# EAGLE design SD_reg (EAGLE 6.2)
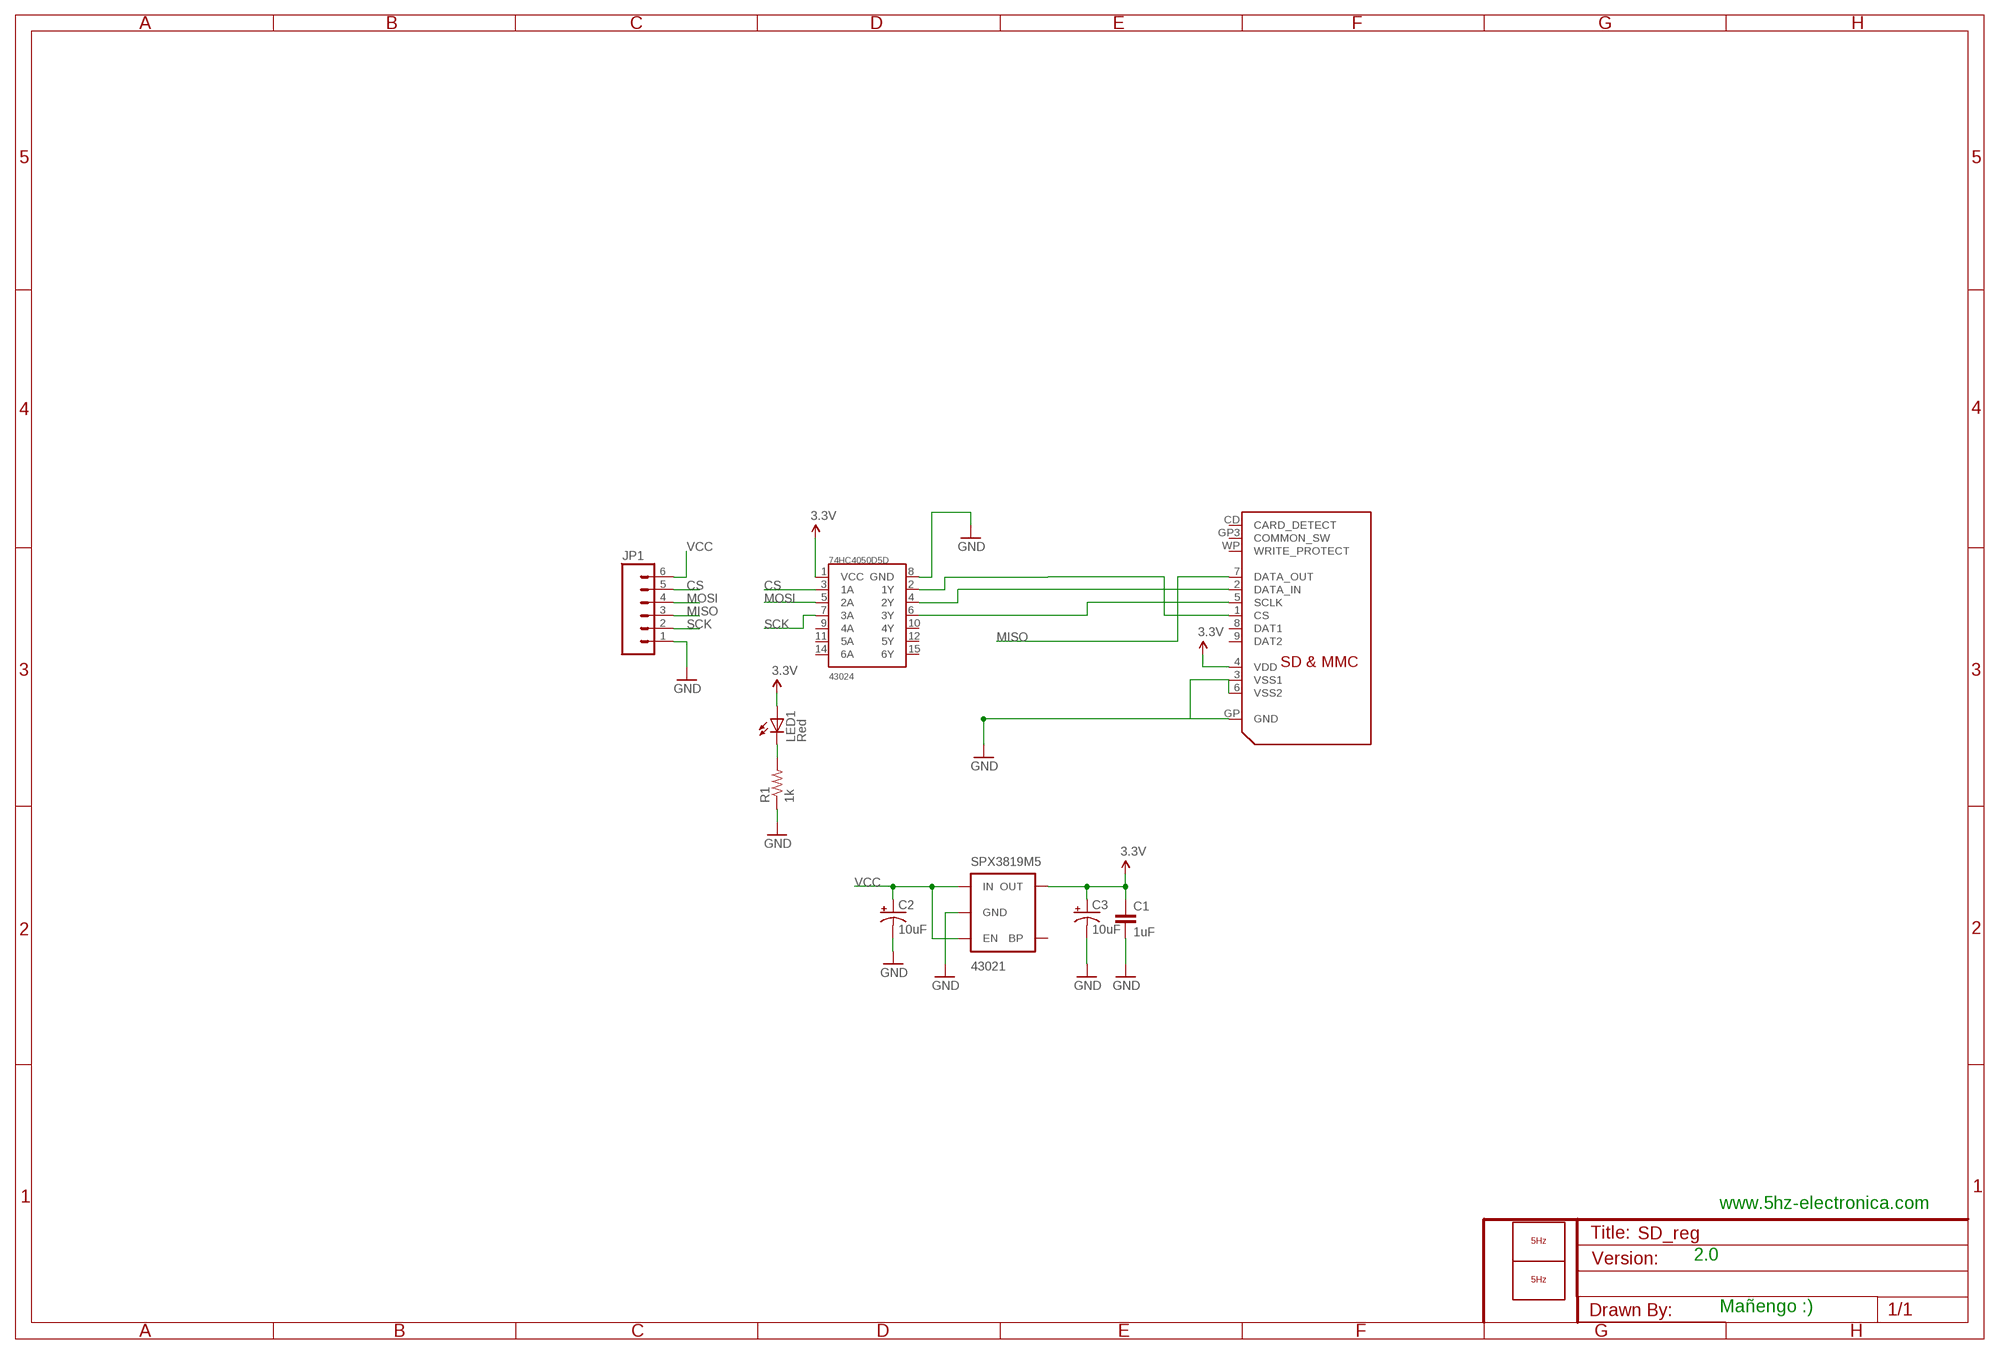
[diagram p0: schematic, sheet 1]

## Parts
74HC4050D5D  43024  HEX_CONVERTER  [SO016]
C1  1uF  CAP0603-CAP  [0603-CAP]
C2  10uF  CAP_POL1206  [EIA3216]
C3  10uF  CAP_POL1206  [EIA3216]
JP1  M06SIP  [1X06]
LED1  Red  LED0603  [LED-0603]
LOGO1  LOGO_5HZ_MAIN_10MM  [5HZ_LOGO_MAIN_10MM]
LOGO2  LOGO_5HZ_CIRC_3MM  [5HZ_LOGO_CIRC_3MM]
R1  1k  RESISTOR0603-RES  [0603-RES]
SPX3819M5  43021  V_REG_LDOSMD  [SOT23-5]
U$1  2041021-4  SDMMC06132  [06132]

## Nets
3.3V: 74HC4050D5D.1(VCC) C1.1 C3.A(+) LED1.A SPX3819M5.5(OUT) U$1.4(VDD)
CS: 74HC4050D5D.3(1A) JP1.5
GND: 74HC4050D5D.8(GND) C1.2 C2.C(-) C3.C(-) JP1.1 R1.1 SPX3819M5.2(GND)
MISO: JP1.3 U$1.7(DATA_OUT)
MOSI: 74HC4050D5D.5(2A) JP1.4
N$2: 74HC4050D5D.4(2Y) U$1.2(DATA_IN)
N$4: 74HC4050D5D.6(3Y) U$1.5(SCLK)
N$6: LED1.C R1.2
N$163: 74HC4050D5D.2(1Y) U$1.1(CS)
SCK: 74HC4050D5D.7(3A) JP1.2
VCC: C2.A(+) JP1.6 SPX3819M5.1(IN) SPX3819M5.3(EN)
VSS2: U$1.3(VSS1) U$1.6(VSS2) U$1.GP(GND) ; supply symbol labelled GND
Unconnected: 74HC4050D5D.9(4A) 74HC4050D5D.10(4Y) 74HC4050D5D.11(5A) 74HC4050D5D.12(5Y) 74HC4050D5D.14(6A) 74HC4050D5D.15(6Y) SPX3819M5.4(BP) U$1.8(DAT1) U$1.9(DAT2) U$1.CD(CARD_DETECT) U$1.GP3(COMMON_SW) U$1.WP(WRITE_PROTECT)

## Notes on the sheet
- www.5hz-electronica.com
- 2.0
- Mañengo :)

## Library data of the parts
74HC4050D5D = SparkFun:HEX_CONVERTER
C1 = SparkFun:CAP: Capacitor Standard 0603 ceramic capacitor, and 0.1" leaded capacitor.
C2 C3 = SparkFun:CAP_POL: Capacitor Polarized These are standard SMD and PTH capacitors. Normally 10uF, 47uF, and 100uF in electrolytic and tantalum varieties. Always verify the external diameter of the through hole cap, it varies with capacity, voltage, and manufacturer. The EIA devices should be standard.
JP1 = SparkFun:M06: Header 6 Standard 6-pin 0.1" header. Use with straight break away headers (SKU : PRT-00116), right angle break away headers (PRT-00553), swiss pins (PRT-00743), machine pins (PRT-00117), and female headers (PRT-00115). Molex polarized connector foot print use with SKU : PRT-08094 with associated crimp pins and housings. NOTES ON THE VARIANTS LOCK and LOCK_LONGPADS... This footprint was designed to help hold the alignment of a through-hole component (i.e. 6-pin header) while soldering it into place. You may notice that each hole has been shifted either up or down by 0.005 of an inch from it's more standard position (which is a perfectly straight line). This slight alteration caused the pins (the squares in the middle) to touch the edges of the holes. Because they are alternating, it causes a "brace" to hold the component in place. 0.005 has proven to be the perfect amount of "off-center" position when using our standard breakaway headers. Although looks a little odd when you look at the bare footprint, once you have a header in there, the alteration is very hard to notice. Also, if you push a header all the way into place, it is covered up entirely on the bottom side. This idea of altering the position of holes to aid alignment will be further integrated into the Sparkfun Library for other footprints. It can help hold any component with 3 or more connection pins.
LED1 = SparkFun:LED: LEDs Standard schematic elements and footprints for 5mm, 3mm, 1206, and 0603 sized LEDs. 5mm - Spark Fun Electronics SKU : COM-00529 (and others)
LOGO1 LOGO2 = 5hz-electronica:LOGO_5HZ: Logotipo 5Hz "según Pedro"
R1 = SparkFun:RESISTOR: Resistor Basic schematic elements and footprints for 0603, 1206, and PTH 1/10th watt (small) resistors.
SPX3819M5 = SparkFun:V_REG_LDO: Voltage Regulator LDO Standard 150mA LDO voltage regulator in SOT-23 layout. Micrel part MIC5205. BP (by-pass) pin is used to lower output noise with 470pF cap.
U$1 = adafruit:SDMMC: SD MMC Card holder 4UCON part #06132 - easy to solder

## Board
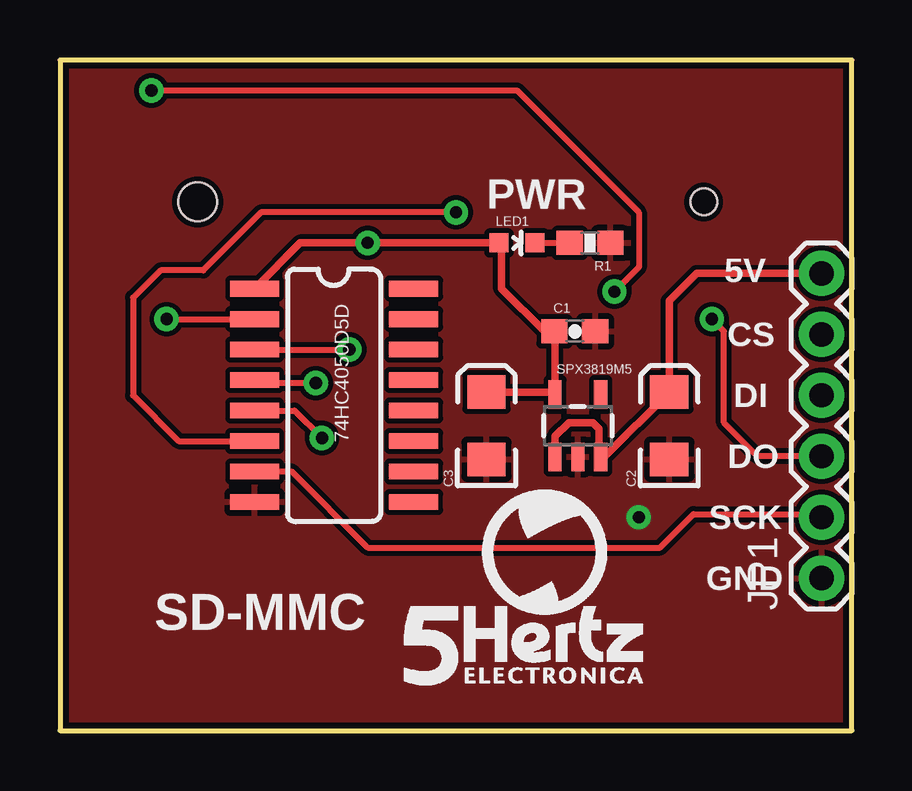
[diagram p1: board, top side]
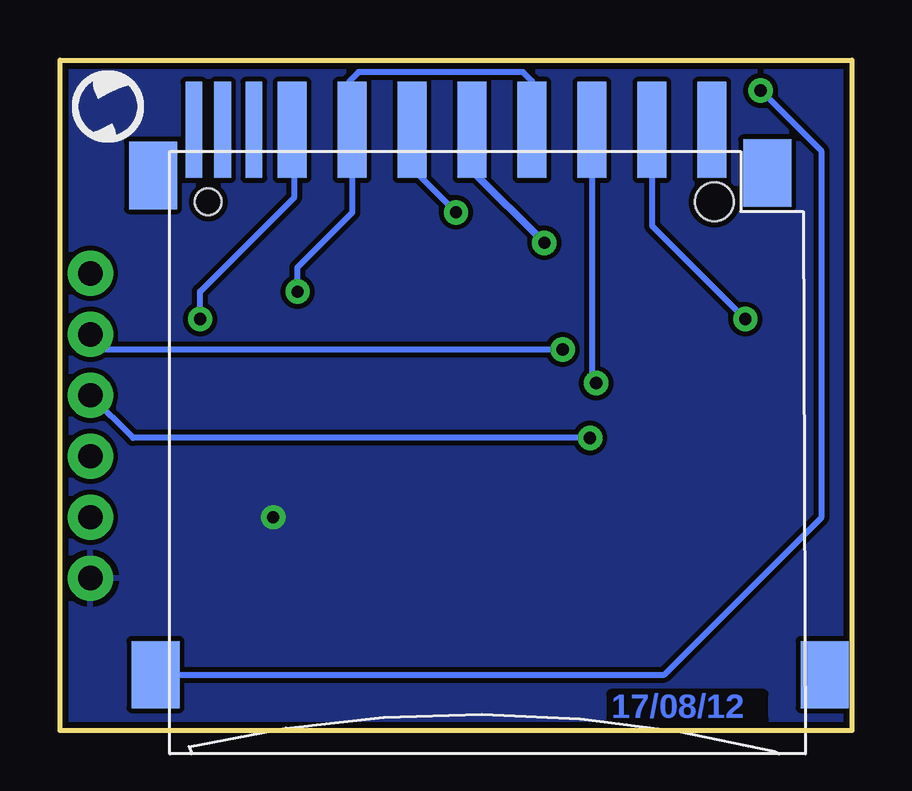
[diagram p2: board, bottom side, seen from below]

Size 33.02 x 27.94 mm. Coordinates in mm from the lower left corner, seen from the top.
Outline: 0,0 33.02,0 33.02,27.94 0,27.94 0,0
Copper layers (1*16): Top 0.035mm / dielectric 1.5mm / Bottom 0.035mm
Design rules: minimum track width 8mil, minimum drill 20mil, track to track 8mil, track to pad 8mil, pad to pad 8mil, via to via 8mil, smd to smd 8mil, copper to edge 10mil, drill to drill 8mil, minimum pad ring 12mil, minimum via ring 10mil, stop-mask expansion 4mil, vias tented up to drill 25mil, thermal gap 10mil

### Footprints (pad centres in the part's own frame; a part is rotated, then mirrored left to right if it is on the bottom)
SO016 = smd 0.66 x 2.032: 1 -4.445,-3.315; 2 -3.175,-3.315; 3 -1.905,-3.315; 4 -0.635,-3.315; 5 0.635,-3.315; 6 1.905,-3.315; 7 3.175,-3.315; 8 4.445,-3.315; 9 4.445,3.315; 10 3.175,3.315; 11 1.905,3.315; 12 0.635,3.315; 13 -0.635,3.315; 14 -1.905,3.315; 15 -3.175,3.315; 16 -4.445,3.315
0603-CAP = smd 1.1 x 1: 1 -0.85,0; 2 0.85,0
EIA3216 = smd 1.4 x 1.6: A 1.4,0; C -1.4,0
1X06 = drill 1.016 pad 1.88: 1 0,0; 2 2.54,0; 3 5.08,0; 4 7.62,0; 5 10.16,0; 6 12.7,0
LED-0603 = smd 0.8 x 0.8: A 0,-0.75; C 0,0.75
0603-RES = smd 1.1 x 1: 1 -0.85,0; 2 0.85,0
SOT23-5 = smd 0.55 x 1.2: 1 -0.95,-1.3; 2 0,-1.3; 3 0.95,-1.3; 4 0.95,1.3; 5 -0.95,1.3
06132 = smd 1.2 x 4: 1 6.9,0.9; 2 4.4,0.9; 3 1.9,0.9; 4 -0.6,0.9; 5 -3.1,0.9; 6 -5.6,0.9; 7 -8.1,0.9; 9 9.4,0.9 | smd 0.7 x 4: 8 -9.7,0.9; CD -11,0.9; WP -12.2,0.9 | smd 2 x 2.8: GP -13.8,-21.8; GP2 14.1,-21.8; GP3 11.7,-0.9; GP4 -13.9,-1 | hole 1.1: -11.6,-2.1 | hole 1.6: 9.5,-2.1

### Placement (x,y rotation side)
74HC4050D5D  11.43,13.97 270 top
C1  21.46,16.64 0 top
C2  25.4,12.7 90 top
C3  17.78,12.7 90 top
JP1  31.75,6.35 90 top
LED1  19.05,20.32 270 top
LOGO1  14.35,1.91 0 top
LOGO2  32.51,24.51 0 bottom
R1  22.1,20.32 180 top
SPX3819M5  21.59,12.7 0 top
U$1  15.24,24.13 0 bottom

### Tracks (layer width: path | path; a pad name or v marks a point on that pad's centre or on a via)
3.3V  (via drill 0.51)
  Top 0.254: 20.54,14.1 SPX3819M5.5 | 20.64,16.61 C1.1 20.19,16.64 | 18.41,20.2 LED1.A
  Top 0.305: 74HC4050D5D.1 10.02,20.32 v12.83,20.32 LED1.A | C3.A 20.54,14.1 | SPX3819M5.5 20.64,16.61 | 20.19,16.64 18.41,18.41 18.41,20.2
  Bottom 0.254: U$1.4 15.84,23.33
  Bottom 0.305: 15.84,23.33 v12.83,20.32
CS  (via drill 0.51)
  Top 0.254: 74HC4050D5D.3 v12.06,15.88
  Bottom 0.254: v12.06,15.88 31.11,15.88 JP1.5
GND  (via drill 0.51)
  other vias: 24.13,8.89
  pour Bottom: 0,27.94 33.02,27.94 33.02,0 0,0
  pour Top: 0,27.94 33.02,27.94 33.02,0 0,0
MISO  (via drill 0.51)
  Top 0.254: JP1.3 29.08,11.43 27.69,12.83 27.69,16.64 v27.18,17.14
  Bottom 0.254: v27.18,17.14 27.18,18.29 23.24,22.23 23.24,24.93 U$1.7
MOSI  (via drill 0.51)
  Top 0.254: 74HC4050D5D.5 9.78,13.34 v10.92,12.19
  Bottom 0.254: v10.92,12.19 29.97,12.19 JP1.4
N$2  (via drill 0.51)
  Top 0.254: v10.67,14.48 8.24,14.48 74HC4050D5D.4
  Bottom 0.254: U$1.2 10.84,14.65 v10.67,14.48
N$4  (via drill 0.51)
  Top 0.254: v16.51,21.59 8.38,21.59 5.97,19.18 4.19,19.18 3.05,18.03 3.05,13.97 4.95,12.06 74HC4050D5D.6
  Bottom 0.254: U$1.5 18.34,23.42 v16.51,21.59
N$6
  Top 0.254: LED1.C R1.2
N$163  (via drill 0.51)
  Top 0.254: v4.45,17.14 74HC4050D5D.2
  Bottom 0.254: U$1.1 8.34,21.04 v4.45,17.14
SCK
  Top 0.254: 74HC4050D5D.7 9.65,10.79 12.83,7.62 25.02,7.62 26.42,9.02 31.62,9.02 JP1.2
VCC
  Top 0.254: 22.48,11.46 SPX3819M5.3 22.7,11.4
  Top 0.305: SPX3819M5.1 20.64,12.26 21.21,12.83 22.23,12.83 22.48,12.57 22.48,11.46 | 22.7,11.4 C2.A 25.4,17.91 26.54,19.05 JP1.6
VSS2  (via drill 0.51)
  Top 0.254: v3.81,26.67 19.05,26.67 24.13,21.59 24.13,19.3 v23.11,18.29
  Bottom 0.254: U$1.3 13.34,27.06 13.72,27.43 20.57,27.43 20.95,27.05 20.95,25.14 U$1.6 20.83,25.02 20.83,21.59 23.11,19.3 v23.11,18.29 | U$1.GP 7.83,2.33 1.27,8.89 1.27,24.13 v3.81,26.67

### Text on the board
Bottom: 17/08/12
tPlace: PWR | 5V | CS | DI | DO | SCK | GND | SD-MMC